# EAGLE design M_B_adapter_414_test (EAGLE 9.6.2)
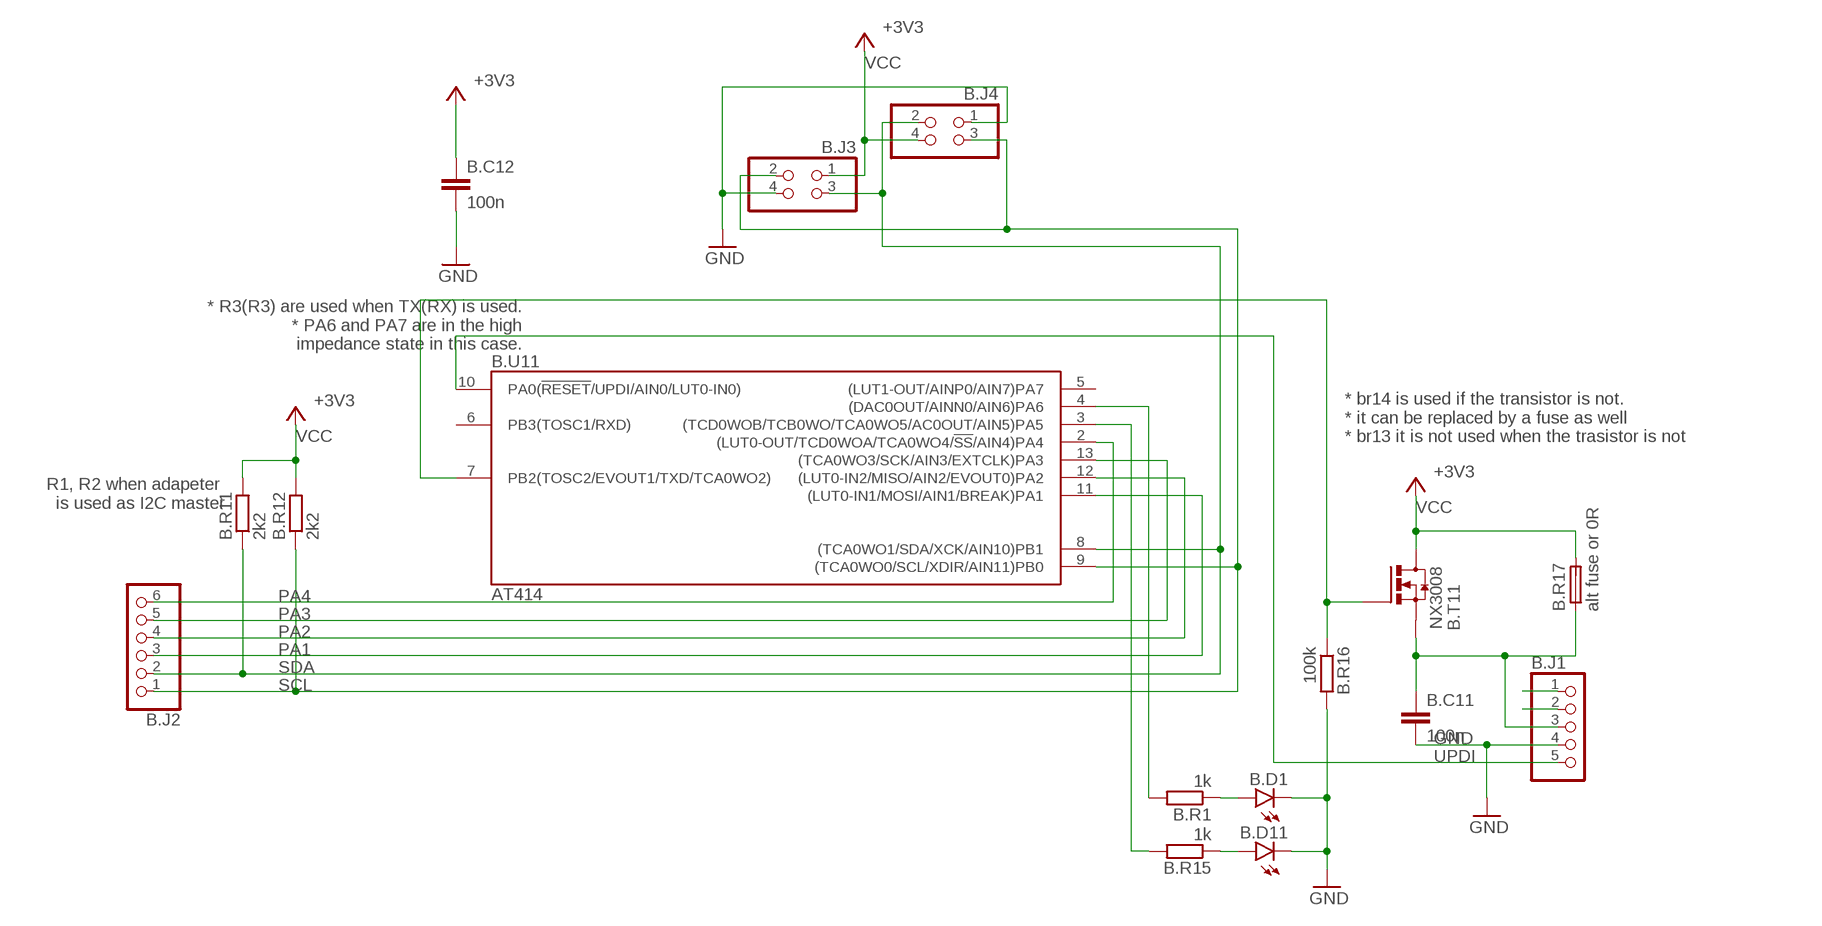
[diagram p0: schematic, sheet 1]

## Parts
B.C11  100n  C-EUC0603  [C0603]
B.C12  100n  C-EUC0603  [C0603]
B.D1  LEDCHIP-LED0603  [CHIP-LED0603]
B.D11  LEDCHIP-LED0603  [CHIP-LED0603]
B.J1  PINHD-1X5  [1X05]
B.J2  PINHD-1X6  [1X06]
B.J3  PINHD-2X2  [2X02]
B.J4  PINHD-2X2  [2X02]
B.R1  1k  R-EU_R0603  [R0603]
B.R11  2k2  R-EU_R0603  [R0603]
B.R12  2k2  R-EU_R0603  [R0603]
B.R15  1k  R-EU_R0603  [R0603]
B.R16  100k  R-EU_R0603  [R0603]
B.R17  alt fuse or 0R  FUSE  [FUSE]
B.T11  NX3008  N-MOSFET  [SO23]
B.U11  AT414  ATTINY414-SSN  [SO14]

## Nets
GND: B.C11.2 B.C12.2 B.D1.C1(C) B.D11.C1(C) B.J1.4 B.J3.4 B.J4.1 B.R16.2
N$3: B.D1.A1(A) B.R1.1
N$4: B.C11.1 B.J1.3 B.R17.1 B.T11.S
PA1: B.J2.3 B.U11.11((LUT0-IN1/MOSI/AIN1/BREAK)PA1)
PA2: B.J2.4 B.U11.12((LUT0-IN2/MISO/AIN2/EVOUT0)PA2)
PA3: B.J2.5 B.U11.13((TCA0WO3/SCK/AIN3/EXTCLK)PA3)
PA4: B.J2.6 B.U11.2((LUT0-OUT/TCD0WOA/TCA0WO4/!SS!/AIN4)PA4)
PA5: B.R15.2 B.U11.3((TCD0WOB/TCB0WO/TCA0WO5/AC0OUT/AIN5)PA5)
PA6: B.R1.2 B.U11.4((DAC0OUT/AINN0/AIN6)PA6)
PA51: B.D11.A1(A) B.R15.1
PB2: B.R16.1 B.T11.G B.U11.7(PB2(TOSC2/EVOUT1/TXD/TCA0WO2))
SCL: B.J2.1 B.J3.2 B.J4.3 B.R12.1 B.U11.9((TCA0WO0/SCL/XDIR/AIN11)PB0)
SDA: B.J2.2 B.J3.3 B.J4.2 B.R11.1 B.U11.8((TCA0WO1/SDA/XCK/AIN10)PB1)
UPDI: B.J1.5 B.U11.10(PA0(!RESET!/UPDI/AIN0/LUT0-IN0))
VBAT: B.J1.2
VCC: B.C12.1 B.J3.1 B.J4.4 B.R11.2 B.R12.2 B.R17.2 B.T11.D ; supply symbol labelled +3V3
VUSB: B.J1.1
Unconnected: B.U11.5((LUT1-OUT/AINP0/AIN7)PA7) B.U11.6(PB3(TOSC1/RXD))

## Notes on the sheet
- * R3(R3) are used when TX(RX) is used. 
  * PA6 and PA7 are in the high 
    impedance state in this case.
- * br14 is used if the transistor is not. 
  * it can be replaced by a fuse as well
  * br13 it is not used when the trasistor is not
- R1, R2 when adapeter 
  is used as I2C master

## Power pins joined to a net without a drawn wire
GND: B.U11.14(GND)
VCC: B.U11.1(VCC)

## Library data of the parts
B.C11 B.C12 = rcl:C-EU: CAPACITOR, European symbol; SPICEPREFIX: C
B.D1 B.D11 = led:LED: LED OSRAM: - CHIPLED LG R971, LG N971, LY N971, LG Q971, LY Q971, LO R971, LY R971 LH N974, LH R974 LS Q976, LO Q976, LY Q976 LO Q996 - Hyper CHIPLED LW Q18S LB Q993, LB Q99A, LB R99A - SideLED LS A670, LO A670, LY A670, LG A670, LP A670 LB A673, LV A673, LT A673, LW A673 LH A674 LY A675 LS A676, LA A676, LO A676, LY A676, LW A676 LS A679, LY A679, LG A679 - Hyper Micro SIDELED® LS Y876, LA Y876, LO Y876, LY Y876 LT Y87S - SmartLED LW L88C, LW L88S LB L89C, LB L89S, LG L890 LS L89K, LO L89K, LY L89K LS L896, LA L896, LO L896, LY L896 - TOPLED LS T670, LO T670, LY T670, LG T670, LP T670 LSG T670, LSP T670, LSY T670, LOP T670, LYG T670 LG T671, LOG T671, LSG T671 LB T673, LV T673, LT T673, LW T673 LH T674 LS T676, LA T676, LO T676, LY T676, LB T676, LH T676, LSB T676, LW T676 LB T67C, LV T67C, LT T67C, LS T67K, LO T67K, LY T67K, LW E67C LS E67B, LA E67B, LO E67B, LY E67B, LB E67C, LV E67C, LT E67C LW T67C LS T679, LY T679, LG T679 LS T770, LO T770, LY T770, LG T770, LP T770 LB T773, LV T773, LT T773, LW T773 LH T774 LS E675, LA E675, LY E675, LS T675 LS T776, LA T776, LO T776, LY T776, LB T776 LHGB T686 LT T68C, LB T68C - Hyper Mini TOPLED® LB M676 - Mini TOPLED Santana® LG M470 LS M47K, LO M47K, LY M47K Source: http://www.osram.convergy.de LUXEON: - LUMILED® LXK2-PW12-R00, LXK2-PW12-S00, LXK2-PW14-U00, LXK2-PW14-V00 LXK2-PM12-R00, LXK2-PM12-S00, LXK2-PM14-U00 LXK2-PE12-Q00, LXK2-PE12-R00, LXK2-PE12-S00, LXK2-PE14-T00, LXK2-PE14-U00 LXK2-PB12-K00, LXK2-PB12-L00, LXK2-PB12-M00, LXK2-PB14-N00, LXK2-PB14-P00, LXK2-PB14-Q00 LXK2-PR12-L00, LXK2-PR12-M00, LXK2-PR14-Q00, LXK2-PR14-R00 LXK2-PD12-Q00, LXK2-PD12-R00, LXK2-PD12-S00 LXK2-PH12-R00, LXK2-PH12-S00 LXK2-PL12-P00, LXK2-PL12-Q00, LXK2-PL12-R00 Source: www.luxeon.com KINGBRIGHT: KA-3528ASYC Source: www.kingbright.com
B.J1 = pinhead2:PINHD-1X5: PIN HEADER
B.J2 = pinhead2:PINHD-1X6: PIN HEADER
B.J3 B.J4 = pinhead2:PINHD-2X2: PIN HEADER
B.R1 B.R11 B.R12 B.R15 B.R16 = rcl:R-EU_: RESISTOR, European symbol; SPICEPREFIX: R
B.R17 = hugo:FUSE
B.T11 = hugo:N-MOSFET
B.U11 = atmel:ATTINY*14: 8-bit AVR tiny-1-series Microcontroller CPU: two-cycle hardware multiplier single pin Unified Program Debug Interface (UPDI) programmable watchdog timer with separate on-chip oscillator programmable brown-out detection circuit with software disable function internal calibrated oscillator Status aktiv aktiv aktiv aktiv ATtiny214 ATtiny414 ATtiny814 ATtiny1614 General purpose working registers 32 SRAM 128 B 256 B 512 B 2 kB Program flash memory 2 kB 4 kB 8 kB 16 kB EEPROM 64 B 128 B 128 B 256 B 16-bit Timer/Counter type A (TCA) 1 16-bit Timer/Counter type B (TCB) 1 2 12-bit Timer/Counter type D (TCD) 1 Real Time Counter (RTC) 1 USART 1 SPI 1 TWI (I2C) 1 ADC 1 2 ADC channels 10 10+4 ADC resolution 10 bit DAC 1 3 AC 1 3 Peripheral Touch Controller (PTC) - 1 PTC number of self-capacitance channels - 6 PTC number of mutual-capacitance channels - 9 Custom Configurable Logic/Lookup tables 1/2 Window Watchdog 1 Event System channels 6 General purpose I/O 12 External interrupts 12 CRCSCAN 1 Operating voltage 1.8 ... 5.5 V Speed grade 0 ... 5 MHz @ 1.8 ... 5.5 V 0 ... 10 MHz @ 2.7 ... 5.5 V 0 ... 20 MHz @ 4.5 ... 5.5 V Clock options internal 16/20 MHz low power RC oscillator internal 32.768 kHz ultra low power RC oscillator external 32.768 kHz low-frequency crystal oscillator external clock input Pin Name Other/Special ADC0 ADC1 PTC AC0 AC1 AC2 DAC0 USART0 SPI0 TWI0 TCA0 TCBn TCD0 CCL PA0 !RESET, UPDI AIN0 LUT0-IN0 PA1 AIN1 TxD MOSI SDA LUT0-IN1 PA2 EVOUT0 AIN2 RxD MISO SCL LUT0-IN2 PA3 EXTCLK AIN3 XCK SCK WO3 TCB1 WO PA4 AIN4 AIN0 X0/Y0 XDIR !SS WO4 WOA LUT0-OUT PA5 VREFA AIN5 AIN1 X1/Y1 OUT AINN0 WO5 TCB0 WO WOB PA6 AIN6 AIN2 X2/Y2 AINN0 AINP1 AINP0 OUT PA7 AIN7 AIN3 X3/Y3 AINP0 AINP0 AINN0 LUT1-OUT PB3 TOSC1 OUT RxD WO0 PB2 TOSC2, EVOUT1 OUT TxD WO2 PB1 AIN10 X4/Y4 AINP2 XCK SDA WO1 PB0 AIN11 X5/Y5 AINP2 AINP1 XDIR SCL WO0 only available in devices with 8/16KByte flash, X- or Y-line only available in device ATtiny1614

## Board
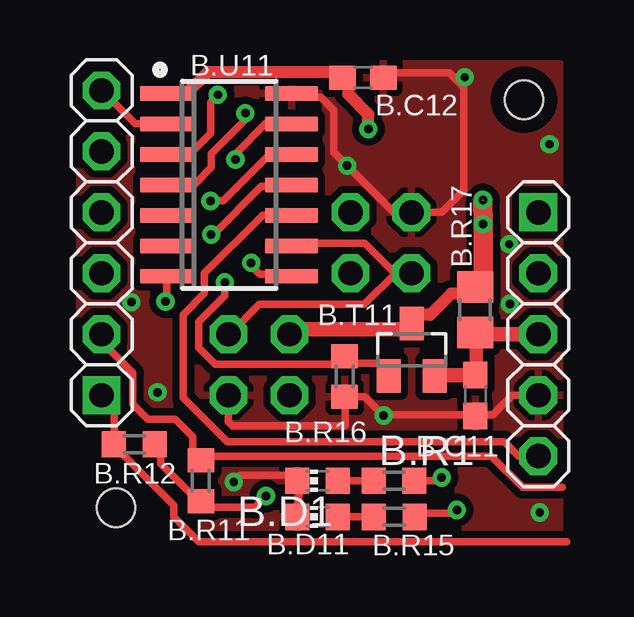
[diagram p1: board, top side]
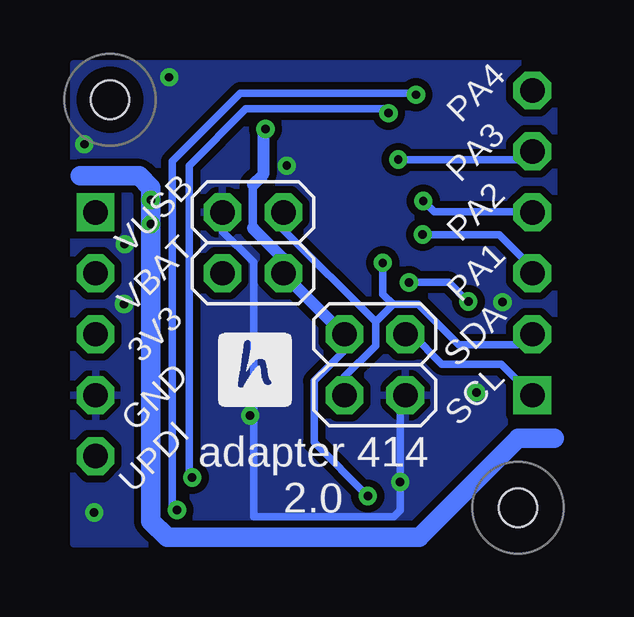
[diagram p2: board, bottom side, seen from below]

No outline drawn. Coordinates in mm, seen from the top.
Copper layers (1*16): Top 0.035mm / dielectric 1.5mm / Bottom 0.035mm
Design rules "default *": minimum track width 10mil, minimum drill 0.35mm, track to track 12mil, track to pad 12mil, pad to pad 12mil, via to via 12mil, smd to smd 10mil, copper to edge 15mil, drill to drill 40mil, minimum pad ring 10mil, minimum via ring 8mil, stop-mask expansion 4mil, vias tented up to drill 14mil, thermal gap 10mil
Holes 1.6 mm at 2,2 19,19
tRestrict: area 18,18 to 20,20; area 1,1 to 3,3
bRestrict: area 18,18 to 20,20; area 1,1 to 3,3

### Footprints (pad centres in the part's own frame; a part is rotated, then mirrored left to right if it is on the bottom)
C0603 = smd 1.1 x 1: 1 -0.85,0; 2 0.85,0
CHIP-LED0603 = smd 1.1 x 1: A1 0,-0.85; C1 0,0.85
1X05 = drill 1.016 pad 1.575 square: 1 -5.08,0 | drill 1.016 pad 1.575 octagon: 2 -2.54,0; 3 0,0; 4 2.54,0; 5 5.08,0
1X06 = drill 1.016 pad 1.575 square: 1 -6.35,0 | drill 1.016 pad 1.575 octagon: 2 -3.81,0; 3 -1.27,0; 4 1.27,0; 5 3.81,0; 6 6.35,0
2X02 = drill 1.016 pad 1.575 octagon: 1 -1.27,-1.27; 2 -1.27,1.27; 3 1.27,-1.27; 4 1.27,1.27
R0603 = smd 1 x 1.1: 1 -0.85,0; 2 0.85,0
FUSE = smd 1.3 x 1.5: 1 -0.95,0; 2 0.95,0
SO23 = smd 1 x 1.4: D 0,1.1; G -0.95,-1.1; S 0.95,-1.1
SO14 = smd 0.6 x 2.2: 1 -3.81,-2.6; 2 -2.54,-2.6; 3 -1.27,-2.6; 4 0,-2.6; 5 1.27,-2.6; 6 2.54,-2.6; 7 3.81,-2.6; 8 3.81,2.6; 9 2.54,2.6; 10 1.27,2.6; 11 0,2.6; 12 -1.27,2.6; 13 -2.54,2.6; 14 -3.81,2.6

### Placement (x,y rotation side)
B.C11  16.97,6.68 270 top
B.C12  12.29,19.91 0 top
B.D1  10.4,3.12 90 top
B.D11  10.4,1.62 90 top
B.J1  19.6,9.23 270 top
B.J2  1.4,13.04 90 top
B.J3  7.96,7.96 270 bottom
B.J4  13.04,13.04 270 bottom
B.R1  13.59,3.12 0 top
B.R11  5.54,3.12 270 top
B.R12  2.77,4.65 0 top
B.R15  13.59,1.62 0 top
B.R16  11.53,7.47 270 top
B.R17  16.97,10.25 90 top
B.T11  14.33,8.59 0 top
B.U11  6.72,15.45 270 top

### Tracks (layer width: path | path; a pad name or v marks a point on that pad's centre or on a via)
GND  (via drill 0.35)
  Top 0.305: B.J3.4 6.69,5.59 6.86,5.42 11.53,5.42 11.55,5.45 11.55,6.6 B.R16.2 12.37,6.62 13.11,5.88 17.7,5.88 18.51,6.69 B.J1.4 | v6.91,3.07 7.18,3.35 9.71,3.35 B.D11.C1 | B.U11.14 9.47,19.11 10.52,19.11 11.07,18.56 11.07,16.82 v11.63,16.26 13.58,14.31 B.J4.1 15.58,14.31 16.49,15.22 16.49,19.51 15.89,20.12 13.35,20.12 B.C12.2
  Bottom 0.305: B.J3.4 6.91,6.47 v6.91,3.07 6.91,1.89 7.17,1.63 13.02,1.63 13.02,12.23 14.31,13.53 B.J4.1
  other vias: 16.54,19.94 13.16,5.84 19.66,1.8 18.41,10.49 2.64,10.57 3.73,6.81 18.39,12.98 20.07,17.14
  pour Bottom (isolate 0.254): 0.5,20.5 0.5,0.5 20.5,0.5 20.5,20.5
  pour Top (isolate 0.254): 0.5,20.5 0.5,0.5 20.5,0.5 20.5,20.5
N$3
  Top 0.305: B.R1.1 B.D1.A1
N$4
  Top 0.305: B.C11.1 17.14,7.71 17.14,9.23
  Top 0.508: B.R17.1 B.C11.1
  Top 0.61: B.J1.3 17.14,9.23 | B.C11.1 15.28,7.53 B.T11.S
PA1  (via drill 0.35)
  Top 0.305: v5.97,13.39 6.04,13.39 8.06,15.4 9.27,15.4 B.U11.11
  Bottom 0.305: B.J2.3 1.4,12 2.79,13.39 v5.97,13.39
PA2  (via drill 0.35)
  Top 0.305: B.U11.12 9.29,16.7 8.39,16.7 6.48,14.78 v5.94,14.78
  Bottom 0.305: v5.94,14.78 5.49,14.33 1.42,14.33 B.J2.4
PA3  (via drill 0.35)
  Top 0.305: B.U11.13 8.22,18 6.99,16.76 v6.99,16.51
  Bottom 0.305: v6.99,16.51 6.97,16.49 1.76,16.49 B.J2.5
PA4
  Top 0.305: B.U11.2 2.79,18 B.J2.6
PA5  (via drill 0.35)
  Top 0.305: v16.2,1.91 16.08,1.78 14.76,1.78 14.52,1.54 B.R15.2 | B.U11.3 4.15,16.75 5.1,16.75 5.94,17.6 5.94,18.9 v6.25,19.21
  Bottom 0.305: v16.2,1.91 16.31,1.91 16.41,2.01 16.41,16.43 13.56,19.28 6.3,19.28 6.3,19.26 v6.25,19.21
PA6  (via drill 0.35)
  Top 0.305: B.U11.4 4.15,15.48 5.28,15.48 5.98,16.18 5.98,16.75 7.39,18.16 v7.39,18.44 | v15.57,3.26 15.43,3.12 B.R1.2
  Bottom 0.305: v7.39,18.44 7.57,18.62 13.33,18.62 15.7,16.26 15.7,3.39 v15.57,3.26
PA51
  Top 0.305: B.R15.1 B.D11.A1
PB2  (via drill 0.35)
  Top 0.305: B.T11.G 13.38,8.01 11.84,8.01 B.R16.1 11.2,7.99 6.13,7.99 5.45,8.67 5.45,9.75 6.54,10.84 v6.54,11.39 | B.U11.7 4.12,10.64 v4.06,10.59
  Bottom 0.305: v4.06,10.59 4.09,10.59 4.88,11.39 v6.54,11.39
SCL
  Top 0.305: B.J3.2 6.73,9.23 7.98,10.47 12.35,10.47 13.65,11.77 B.J4.3 13.62,11.77 12.37,13.02 9.42,13.02 B.U11.9 | B.J2.1 1.93,6.16 1.93,4.66 B.R12.1 1.92,4.6 4.42,2.1 4.42,1.63 5.45,0.59 20.78,0.59
  Bottom 0.305: B.J2.1 2.69,7.99 5.17,7.99 6.41,9.23 B.J3.2
SDA  (via drill 0.35)
  Top 0.305: B.J2.2 1.4,8.93 2.7,7.62 2.7,6.32 3.33,5.69 4.48,5.69 5.21,4.96 5.21,4.3 B.R11.1 5.71,4.15 17.64,4.15 18.95,2.85 20.6,2.85 | 8.37,11.64 B.U11.8 9.24,11.72 7.99,11.72 7.63,12.08 v7.63,12.21
  Bottom 0.305: B.J4.2 11.77,13.58 7.93,9.75 | B.J2.2 1.6,9.23 2.04,8.8 4.47,8.8 6.15,10.47 7.21,10.47 | 7.93,9.75 7.21,10.47 | 7.93,9.75 7.93,8.75 9.23,7.45 B.J3.3 | 7.21,10.47 7.63,10.9 v7.63,12.21
UPDI
  Top 0.305: B.U11.10 8.11,14.19 5.69,11.77 5.69,10.93 4.81,10.05 4.81,6.58 6.63,4.76 18.18,4.76 18.79,4.15 B.J1.5
VCC  (via drill 0.35)  (1 unrouted)
  Top 0.305: B.T11.D 14.07,9.43 | B.J3.1 9.43,9.43 | B.R12.2 3.87,4.39 3.87,3.84 5.44,2.27 B.R11.2 | 5.84,2.58 B.R11.2 | 17.02,11.25 B.R17.2 | B.R11.2 5.79,2.02 7.79,2.02 v8.26,2.49 | 11.67,19.68 B.C12.1
  Top 0.508: B.U11.1 4.96,19.27 5.84,20.15 11.29,20.15 11.44,19.99 B.C12.1 11.57,19.79 | B.T11.D 14.68,10.04 15.09,10.04 15.97,10.92 16.69,10.92 B.R17.2 | 12.39,17.78 v12.52,17.78 12.52,18.39 11.67,19.24 11.67,19.68
  Top 0.61: 14.07,9.43 9.43,9.43
  Top 0.813: B.R17.2 17.3,11.53 v17.3,13.81 v17.3,13.82 17.3,14.8
  Bottom 0.305: v8.26,2.49 10.49,4.72 10.49,7.28 9.23,8.54 B.J3.1
  Bottom 0.356: 13.04,13.65 13.04,15.46
  Bottom 0.508: B.J3.1 9.26,9.23 11.77,11.74 B.J4.4 11.77,12.38 13.04,13.65 | v12.52,17.78 12.62,17.68 12.62,15.88 13.04,15.46
  Bottom 0.813: v17.3,13.82 17.3,13.84 | v17.3,13.82 17.3,1.45 16.61,0.76 6.12,0.76 1.98,4.9 0.48,4.9 | v17.3,13.82 17.3,12.83 | v17.3,13.82 17.3,15.34 17.78,15.82 20.24,15.82
  other vias: 17.3,14.83

### Text on the board
bPlace: PA4 | PA3 | PA2 | VUSB | PA1 | VBAT | SDA | 3V3 | SCL | GND | UPDI | adapter 414 / 2.0